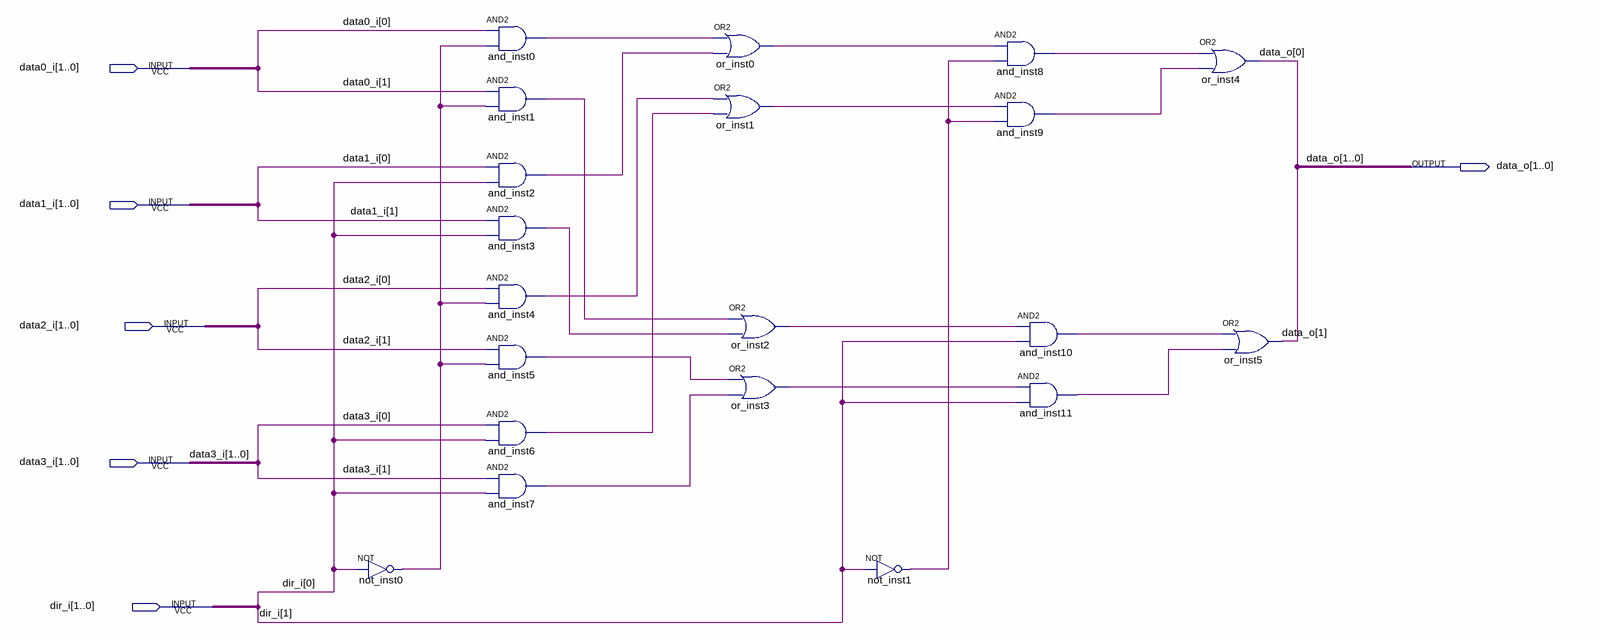
[diagram p0: schematic sheet]
// Quartus schematic mux4.bdf as structural Verilog: 20 symbols, 6 pins
module mux4 (
  input  [1:0] data0_i,
  input  [1:0] data1_i,
  input  [1:0] data2_i,
  input  [1:0] data3_i,
  input  [1:0] dir_i,
  output [1:0] data_o
);

  wire and_inst0_out, and_inst1_out, and_inst2_out, and_inst3_out, and_inst4_out, and_inst5_out,
       and_inst6_out, and_inst7_out, and_inst8_out, and_inst9_out, and_inst10_out, and_inst11_out,
       not_inst0_out, not_inst1_out, or_inst0_out, or_inst1_out, or_inst2_out, or_inst3_out;

  not not_inst0 (not_inst0_out, dir_i[0]);
  and and_inst0 (and_inst0_out, data0_i[0], not_inst0_out);
  and and_inst1 (and_inst1_out, data0_i[1], not_inst0_out);
  and and_inst2 (and_inst2_out, data1_i[0], dir_i[0]);
  and and_inst3 (and_inst3_out, data1_i[1], dir_i[0]);
  and and_inst4 (and_inst4_out, data2_i[0], not_inst0_out);
  and and_inst5 (and_inst5_out, data2_i[1], not_inst0_out);
  and and_inst6 (and_inst6_out, data3_i[0], dir_i[0]);
  and and_inst7 (and_inst7_out, data3_i[1], dir_i[0]);
  or or_inst0 (or_inst0_out, and_inst0_out, and_inst2_out);
  or or_inst1 (or_inst1_out, and_inst4_out, and_inst6_out);
  or or_inst2 (or_inst2_out, and_inst1_out, and_inst3_out);
  or or_inst3 (or_inst3_out, and_inst5_out, and_inst7_out);
  not not_inst1 (not_inst1_out, dir_i[1]);
  and and_inst8 (and_inst8_out, or_inst0_out, not_inst1_out);
  and and_inst9 (and_inst9_out, or_inst1_out, not_inst1_out);
  and and_inst10 (and_inst10_out, or_inst2_out, dir_i[1]);
  and and_inst11 (and_inst11_out, or_inst3_out, dir_i[1]);
  or or_inst4 (data_o[0], and_inst8_out, and_inst9_out);
  or or_inst5 (data_o[1], and_inst10_out, and_inst11_out);
endmodule
